# EAGLE design usocket (EAGLE 4.16)
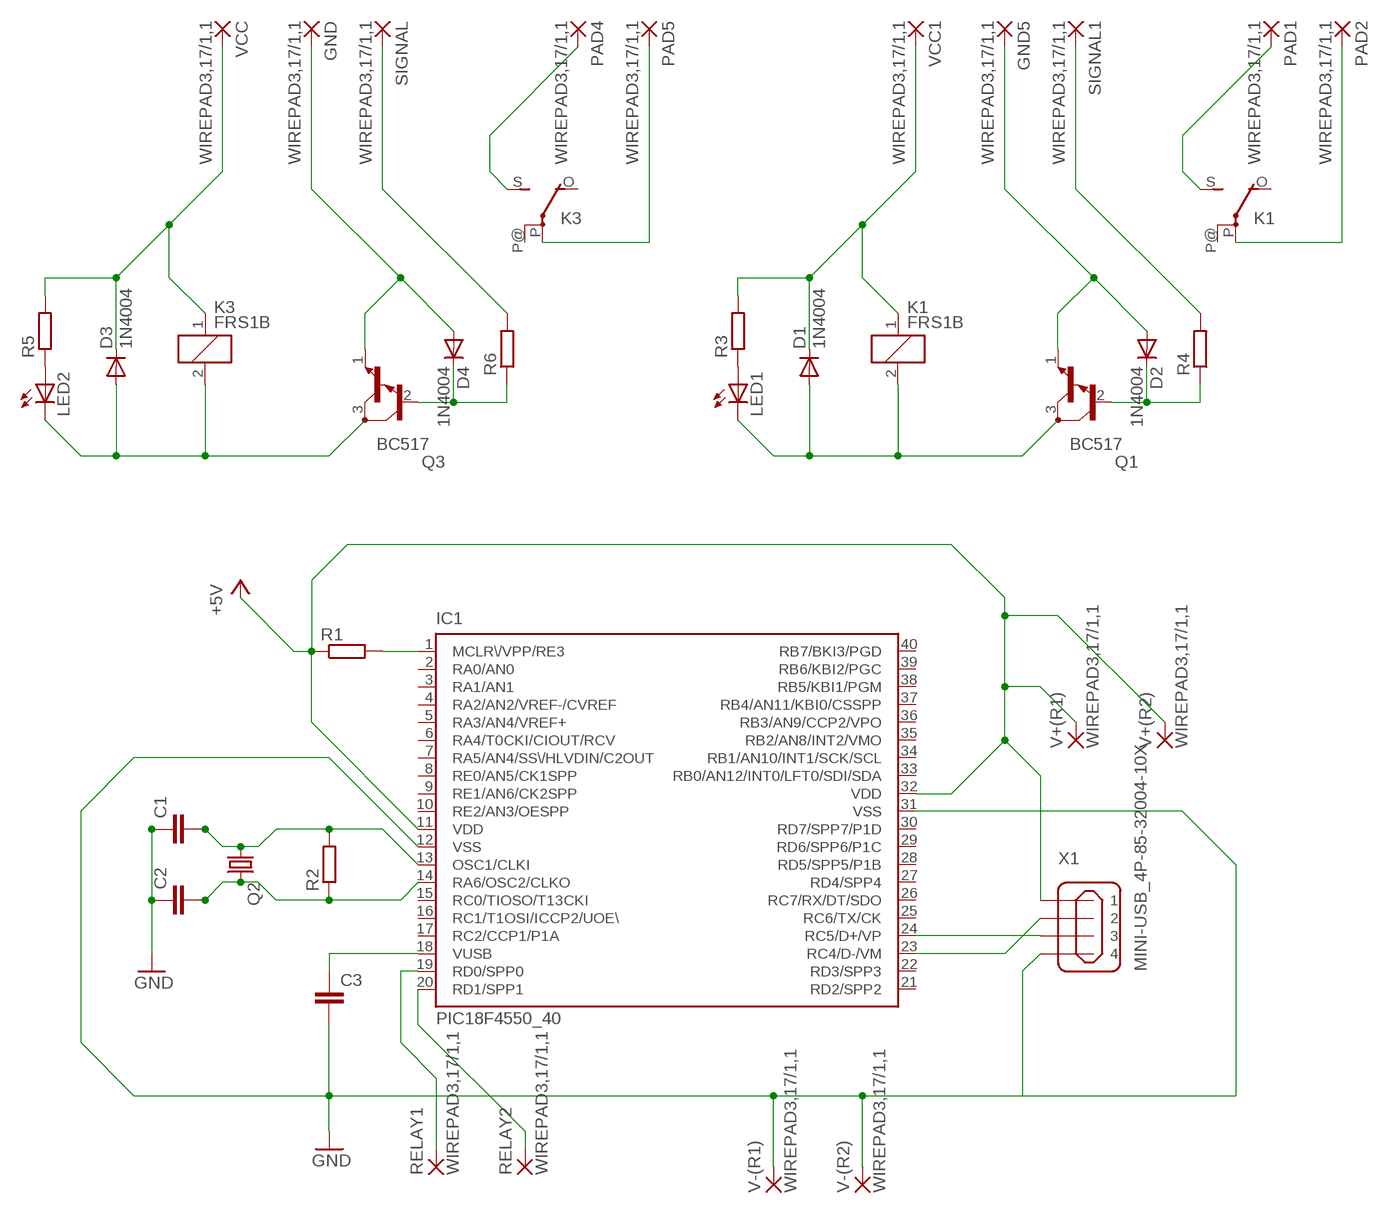
[diagram p0: schematic, sheet 1]

## Parts
C1  C-EU025-025X050  [C025-025X050]
C2  C-EU025-025X050  [C025-025X050]
C3  C-EU025-025X050  [C025-025X050]
D1  1N4004  [DO41-10]
D2  1N4004  [DO41-10]
D3  1N4004  [DO41-10]
D4  1N4004  [DO41-10]
GND  WIREPAD3,17/1,1  [3,17/1,1]
GND5  WIREPAD3,17/1,1  [3,17/1,1]
IC1  PIC18F4550_40  [DIL40]
K1  FRS1B  [FRS1B]
K3  FRS1B  [FRS1B]
LED1  LED5MM  [LED5MM]
LED2  LED5MM  [LED5MM]
PAD1  WIREPAD3,17/1,1  [3,17/1,1]
PAD2  WIREPAD3,17/1,1  [3,17/1,1]
PAD4  WIREPAD3,17/1,1  [3,17/1,1]
PAD5  WIREPAD3,17/1,1  [3,17/1,1]
Q1  BC517  [TO92]
Q2  CRYSTALHC49U-V  [HC49U-V]
Q3  BC517  [TO92]
R1  R-EU_0207/7  [0207/7]
R2  R-EU_0207/7  [0207/7]
R3  R-EU_0207/7  [0207/7]
R4  R-EU_0207/7  [0207/7]
R5  R-EU_0207/7  [0207/7]
R6  R-EU_0207/7  [0207/7]
RELAY1  WIREPAD3,17/1,1  [3,17/1,1]
RELAY2  WIREPAD3,17/1,1  [3,17/1,1]
SIGNAL  WIREPAD3,17/1,1  [3,17/1,1]
SIGNAL1  WIREPAD3,17/1,1  [3,17/1,1]
V+(R1)  WIREPAD3,17/1,1  [3,17/1,1]
V+(R2)  WIREPAD3,17/1,1  [3,17/1,1]
V-(R1)  WIREPAD3,17/1,1  [3,17/1,1]
V-(R2)  WIREPAD3,17/1,1  [3,17/1,1]
VCC  WIREPAD3,17/1,1  [3,17/1,1]
VCC1  WIREPAD3,17/1,1  [3,17/1,1]
X1  MINI-USB_4P-85-32004-10X  [85-32004-10X]

## Nets
+5V: IC1.11(VDD) IC1.32(VDD) R1.1 V+(R1).1(P) V+(R2).1(P) X1.1
GND: C1.1 C2.1 C3.2 IC1.12(VSS) IC1.31(VSS) V-(R1).1(P) V-(R2).1(P) X1.4
N$1: IC1.1(MCLR\/VPP/RE3) R1.2
N$2: R6.2 SIGNAL.1(P)
N$3: C1.2 IC1.13(OSC1/CLKI) Q2.1 R2.2
N$4: C2.2 IC1.14(RA6/OSC2/CLKO) Q2.2 R2.1
N$5: K3.P(2:P) PAD5.1(P)
N$6: C3.1 IC1.18(VUSB)
N$7: K3.S(2:S) PAD4.1(P)
N$8: LED2.A R5.1
N$9: IC1.23(RC4/D-/VM) X1.2
N$10: IC1.24(RC5/D+/VP) X1.3
N$11: IC1.20(RD1/SPP1) RELAY2.1(P)
N$12: IC1.19(RD0/SPP0) RELAY1.1(P)
N$13: LED1.A R3.1
N$14: D3.A K3.2 LED2.K(C) Q3.3(C)
N$15: D4.C Q3.2(B) R6.1
N$16: R4.2 SIGNAL1.1(P)
N$17: D1.A K1.2 LED1.K(C) Q1.3(C)
N$18: D2.C Q1.2(B) R4.1
N$19: K1.P(2:P) PAD2.1(P)
N$20: K1.S(2:S) PAD1.1(P)
N$21: D3.C K3.1 R5.2 VCC.1(P)
N$22: D1.C K1.1 R3.2 VCC1.1(P)
N$23: D2.A GND5.1(P) Q1.1(E)
N$24: D4.A GND.1(P) Q3.1(E)
Unconnected: IC1.2(RA0/AN0) IC1.3(RA1/AN1) IC1.4(RA2/AN2/VREF-/CVREF) IC1.5(RA3/AN4/VREF+) IC1.6(RA4/T0CKI/CIOUT/RCV) IC1.7(RA5/AN4/SS\/HLVDIN/C2OUT) IC1.8(RE0/AN5/CK1SPP) IC1.9(RE1/AN6/CK2SPP) IC1.10(RE2/AN3/OESPP) IC1.15(RC0/TIOSO/T13CKI) IC1.16(RC1/T1OSI/ICCP2/UOE\) IC1.17(RC2/CCP1/P1A) IC1.21(RD2/SPP2) IC1.22(RD3/SPP3) IC1.25(RC6/TX/CK) IC1.26(RC7/RX/DT/SDO) IC1.27(RD4/SPP4) IC1.28(RD5/SPP5/P1B) IC1.29(RD6/SPP6/P1C) IC1.30(RD7/SPP7/P1D) IC1.33(RB0/AN12/INT0/LFT0/SDI/SDA) IC1.34(RB1/AN10/INT1/SCK/SCL) IC1.35(RB2/AN8/INT2/VMO) IC1.36(RB3/AN9/CCP2/VPO) IC1.37(RB4/AN11/KBI0/CSSPP) IC1.38(RB5/KBI1/PGM) IC1.39(RB6/KBI2/PGC) IC1.40(RB7/BKI3/PGD) K1.O(2:O) K1.P@(2:P) K3.O(2:O) K3.P@(2:P)

## Library data of the parts
C1-C3 = rcl:C-EU: CAPACITOR, European symbol
D1-D4 = diode:1N4004: DIODE general purpose rectifier, 1 A
GND GND5 PAD1 PAD2 PAD4 PAD5 RELAY1 RELAY2 SIGNAL SIGNAL1 V+(R1) V+(R2) V-(R1) V-(R2) VCC VCC1 = wirepad:WIREPAD: Wire PAD connect wire on PCB
IC1 = microchip:PIC18F4*_40: USB Microcontrollers with nanoWatt Technology High-Performance, Enhanced Flash, 28/40/44-Pin, Source: http://ww1.microchip.com/downloads/en/devicedoc/39632c.pdf
K1 K3 = relay-fujitsu:FRS1B: RELAY 1 x switch, same as V23101-D6-A201, Siemens
LED1 LED2 = led:LED: LED OSRAM: - CHIPLED LG R971, LG N971, LY N971, LG Q971, LY Q971, LO R971, LY R971 LH N974, LH R974 LS Q976, LO Q976, LY Q976 LO Q996 - Hyper CHIPLED LW Q18S LB Q993, LB Q99A, LB R99A - SideLED LS A670, LO A670, LY A670, LG A670, LP A670 LB A673, LV A673, LT A673, LW A673 LH A674 LY A675 LS A676, LA A676, LO A676, LY A676, LW A676 LS A679, LY A679, LG A679 - Hyper Micro SIDELED® LS Y876, LA Y876, LO Y876, LY Y876 LT Y87S - SmartLED LW L88C, LW L88S LB L89C, LB L89S, LG L890 LS L89K, LO L89K, LY L89K LS L896, LA L896, LO L896, LY L896 - TOPLED LS T670, LO T670, LY T670, LG T670, LP T670 LSG T670, LSP T670, LSY T670, LOP T670, LYG T670 LG T671, LOG T671, LSG T671 LB T673, LV T673, LT T673, LW T673 LH T674 LS T676, LA T676, LO T676, LY T676, LB T676, LH T676, LSB T676, LW T676 LB T67C, LV T67C, LT T67C, LS T67K, LO T67K, LY T67K, LW E67C LS E67B, LA E67B, LO E67B, LY E67B, LB E67C, LV E67C, LT E67C LW T67C LS T679, LY T679, LG T679 LS T770, LO T770, LY T770, LG T770, LP T770 LB T773, LV T773, LT T773, LW T773 LH T774 LS E675, LA E675, LY E675, LS T675 LS T776, LA T776, LO T776, LY T776, LB T776 LHGB T686 LT T68C, LB T68C - Hyper Mini TOPLED® LB M676 - Mini TOPLED Santana® LG M470 LS M47K, LO M47K, LY M47K Source: http://www.osram.convergy.de - LUMILED® LXK2-PW12-R00, LXK2-PW12-S00, LXK2-PW14-U00, LXK2-PW14-V00 LXK2-PM12-R00, LXK2-PM12-S00, LXK2-PM14-U00 LXK2-PE12-Q00, LXK2-PE12-R00, LXK2-PE12-S00, LXK2-PE14-T00, LXK2-PE14-U00 LXK2-PB12-K00, LXK2-PB12-L00, LXK2-PB12-M00, LXK2-PB14-N00, LXK2-PB14-P00, LXK2-PB14-Q00 LXK2-PR12-L00, LXK2-PR12-M00, LXK2-PR14-Q00, LXK2-PR14-R00 LXK2-PD12-Q00, LXK2-PD12-R00, LXK2-PD12-S00 LXK2-PH12-R00, LXK2-PH12-S00 LXK2-PL12-P00, LXK2-PL12-Q00, LXK2-PL12-R00 Source: www.luxeon.com
Q1 Q3 = transistor-npn:BC517*: NPN Darlington Transistor
Q2 = crystal:CRYSTAL: CRYSTAL
R1-R6 = rcl:R-EU_: RESISTOR, European symbol
X1 = con-cypressindustries:MINI-USB_4P-: MINI USB 4 Pol. Source: www.cypressindustries.com

## Board
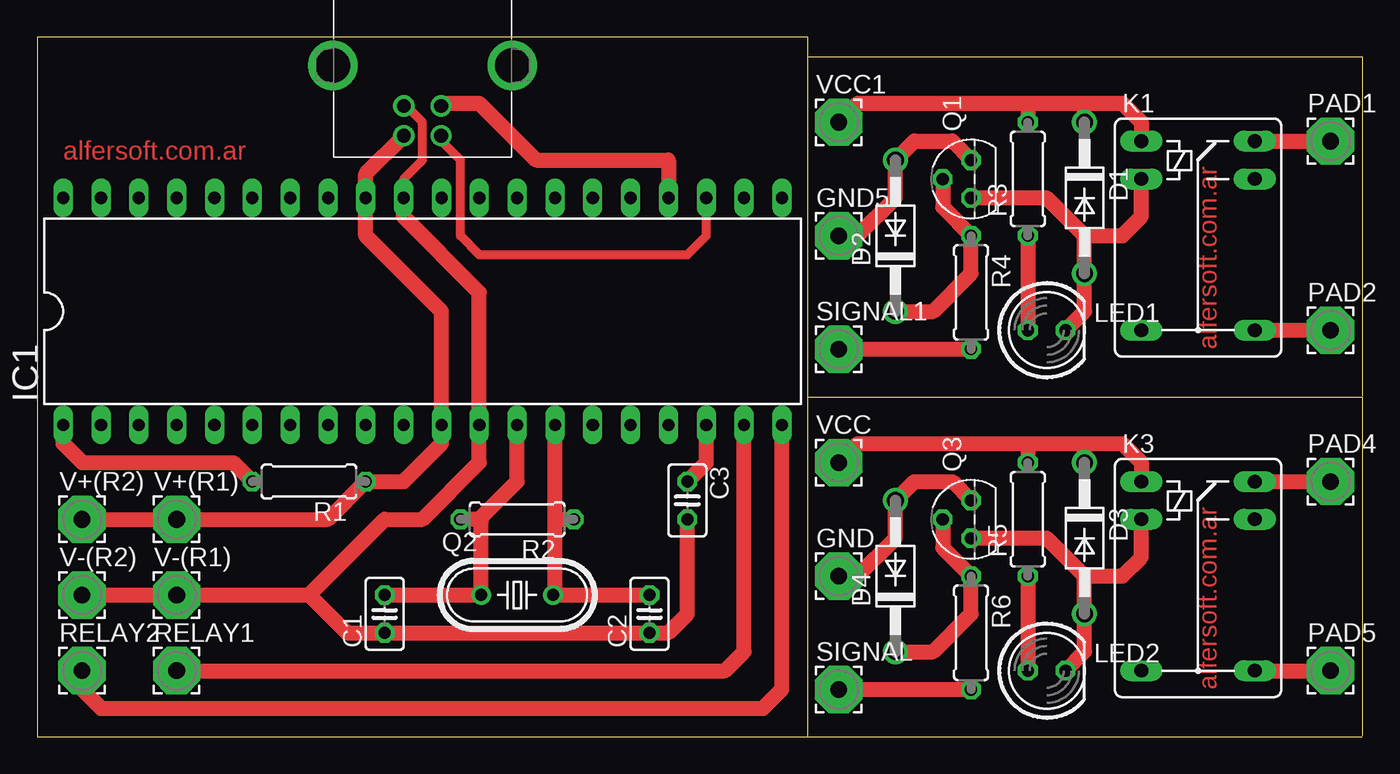
[diagram p1: board, top side]

Size 88.96 x 46.98 mm. Coordinates in mm from the lower left corner, seen from the top.
Outline: 88.97,0.07 88.97,22.82 51.77,22.82
Outline: 88.97,22.89 88.97,45.69 51.77,45.69
Outline: 51.77,0 88.97,0
Outline: 0,0 51.74,0 51.74,46.98 0,46.98 0,0
Copper layers 1: Top 0.035mm
Design rules "default": minimum track width 16mil, minimum drill 24mil, track to track 8mil, track to pad 8mil, pad to pad 8mil, via to via 8mil, smd to smd 8mil, copper to edge 40mil, drill to drill 8mil, minimum pad ring 10mil, minimum via ring 8mil, stop-mask expansion 4mil, vias tented up to drill 0mil, thermal gap 10mil

### Footprints (pad centres in the part's own frame; a part is rotated, then mirrored left to right if it is on the bottom)
C025-025X050 = drill 0.813 octagon: 1 -1.27,0; 2 1.27,0
DO41-10 = drill 1.118 round: A 5.08,0; C -5.08,0
3,17/1,1 = drill 1.118 pad 3.175 octagon: 1 0,0
DIL40 = drill 0.813 long: 1 -24.13,-7.62; 2 -21.59,-7.62; 3 -19.05,-7.62; 4 -16.51,-7.62; 5 -13.97,-7.62; 6 -11.43,-7.62; 7 -8.89,-7.62; 8 -6.35,-7.62; 9 -3.81,-7.62; 10 -1.27,-7.62; 11 1.27,-7.62; 12 3.81,-7.62; 13 6.35,-7.62; 14 8.89,-7.62; 15 11.43,-7.62; 16 13.97,-7.62; 17 16.51,-7.62; 18 19.05,-7.62; 19 21.59,-7.62; 20 24.13,-7.62; 21 24.13,7.62; 22 21.59,7.62; 23 19.05,7.62; 24 16.51,7.62; 25 13.97,7.62; 26 11.43,7.62; 27 8.89,7.62; 28 6.35,7.62; 29 3.81,7.62; 30 1.27,7.62; 31 -1.27,7.62; 32 -3.81,7.62; 33 -6.35,7.62; 34 -8.89,7.62; 35 -11.43,7.62; 36 -13.97,7.62; 37 -16.51,7.62; 38 -19.05,7.62; 39 -21.59,7.62; 40 -24.13,7.62
FRS1B = drill 0.914 long: 1 -2.54,-3.81; 2 0,-3.81; O 0,3.81; P 10.16,3.81; P@ 10.16,-3.81; S -2.54,3.81
LED5MM = drill 0.813 octagon: A -1.27,0; K 1.27,0
TO92 = drill 0.813 octagon: 1 1.27,0; 2 0,1.905; 3 -1.27,0
HC49U-V = drill 0.813 round: 1 -2.413,0; 2 2.413,0
0207/7 = drill 0.813 octagon: 1 -3.81,0; 2 3.81,0
85-32004-10X = drill 0.92 pad 1.27 round: 1 4.71,-1.25; 2 4.71,1.25; 3 2.71,1.25; 4 2.71,-1.25 | drill 2.3 pad 3 round: M1 0,6.02; M2 0,-6.02

### Placement (x,y rotation side)
C1  23.33,8.25 90 top
C2  41.11,8.25 90 top
C3  43.65,15.87 270 top
D1  70.32,36.19 270 top
D2  57.62,33.65 90 top
D3  70.32,13.33 270 top
D4  57.62,10.79 90 top
GND  53.81,10.79 0 top
GND5  53.81,33.65 0 top
IC1  25.87,28.57 0 top
K1  77.94,37.46 270 top
K3  77.94,14.6 270 top
LED1  67.78,27.3 0 top
LED2  67.78,4.44 0 top
PAD1  86.83,40 0 top
PAD2  86.83,27.3 0 top
PAD4  86.83,17.14 0 top
PAD5  86.83,4.44 0 top
Q1  62.7,37.46 90 top
Q2  32.22,9.52 0 top
Q3  62.7,14.6 90 top
R1  18.25,17.14 180 top
R2  32.22,14.6 180 top
R3  66.51,37.46 90 top
R4  62.7,29.84 270 top
R5  66.51,14.6 90 top
R6  62.7,6.98 270 top
RELAY1  9.36,4.44 0 top
RELAY2  3.01,4.44 0 top
SIGNAL  53.81,3.17 0 top
SIGNAL1  53.81,26.03 0 top
V+(R1)  9.36,14.6 0 top
V+(R2)  3.01,14.6 0 top
V-(R1)  9.36,9.52 0 top
V-(R2)  3.01,9.52 0 top
VCC  53.81,18.41 0 top
VCC1  53.81,41.27 0 top
X1  25.87,45.08 270 top

### Tracks (layer width: path | path; a pad name or v marks a point on that pad's centre or on a via)
+5V
  Top 1.016: V+(R2).1 V+(R1).1 19.52,14.6 R1.1 24.6,17.14 27.14,19.68 IC1.11 27.14,28.57 22.06,33.65 IC1.32 22.06,37.81 X1.1
GND
  Top 0.61: X1.4 24.77,42.37 25.87,41.27 25.87,38.73 24.6,37.46 IC1.31
  Top 1.016: IC1.31 24.6,34.92 29.68,29.84 IC1.12 29.68,18.41 25.87,14.6 23.33,14.6 18.25,9.52 | V-(R2).1 V-(R1).1 18.25,9.52 | 18.25,9.52 20.79,6.98 C1.1 C2.1 42.38,6.98 43.65,8.25 C3.2
N$1
  Top 1.016: IC1.1 1.74,19.68 3.01,18.41 13.17,18.41 R1.2
N$2
  Top 1.016: SIGNAL.1 R6.2
N$3
  Top 1.016: C1.2 Q2.1 29.81,14.47 29.68,14.6 | IC1.13 32.22,17.14 29.68,14.6 | 29.68,14.6 R2.2
N$4
  Top 1.016: 34.76,9.52 C2.2 | Q2.2 34.76,9.52 | 34.76,9.52 34.76,14.6 | 34.76,14.6 IC1.14 | 34.76,14.6 R2.1
N$5
  Top 1.016: K3.P PAD5.1
N$6
  Top 1.016: C3.1 44.92,18.41 IC1.18
N$7
  Top 1.016: K3.S PAD4.1
N$8
  Top 1.016: R5.1 LED2.A
N$9
  Top 0.61: IC1.23 44.92,33.65 43.65,32.38 29.68,32.38 28.41,33.65 28.41,38.73 27.12,40.02 X1.2
N$10
  Top 1.016: IC1.24 42.38,38.73 33.49,38.73 29.68,42.54 27.29,42.54 X1.3
N$11
  Top 1.016: IC1.20 50,3.17 48.73,1.9 4.28,1.9 3.01,3.17 RELAY2.1
N$12
  Top 1.016: RELAY1.1 46.19,4.44 47.46,5.71 IC1.19
N$13
  Top 1.016: R3.1 LED1.A
N$14
  Top 1.016: Q3.3 67.78,13.33 70.32,10.79 | 70.32,10.79 D3.A 70.32,5.71 LED2.K | 70.32,10.79 72.86,10.79 74.13,12.06 K3.2
N$15
  Top 1.016: D4.C 60.16,5.71 62.7,8.25 R6.1 60.8,12.7 Q3.2
N$16
  Top 1.016: SIGNAL1.1 R4.2
N$17
  Top 1.016: Q1.3 67.78,36.19 70.32,33.65 | 70.32,33.65 D1.A 70.32,28.57 LED1.K | K1.2 74.13,34.92 72.86,33.65 70.32,33.65
N$18
  Top 1.016: D2.C 60.16,28.57 62.7,31.11 R4.1 60.8,35.55 Q1.2
N$19
  Top 1.016: K1.P PAD2.1
N$20
  Top 1.016: K1.S PAD1.1
N$21
  Top 1.016: VCC.1 55.08,19.68 66.51,19.68 | 66.51,19.68 R5.2 | 66.51,19.68 70.32,19.68 | D3.C 70.32,19.68 | 70.32,19.68 72.86,19.68 74.13,18.41 K3.1
N$22
  Top 1.016: VCC1.1 55.08,42.54 66.51,42.54 | 66.51,42.54 R3.2 | 66.51,42.54 70.32,42.54 | D1.C 70.32,42.54 | 70.32,42.54 72.86,42.54 74.13,41.27 K1.1
N$23
  Top 1.016: GND5.1 55.08,33.65 57.62,36.19 D2.A 58.89,40 61.43,40 Q1.1
N$24
  Top 1.016: GND.1 55.08,10.79 57.62,13.33 D4.A 58.89,17.14 61.43,17.14 Q3.1

### Text on the board
Top: alfersoft.com.ar | alfersoft.com.ar | alfersoft.com.ar